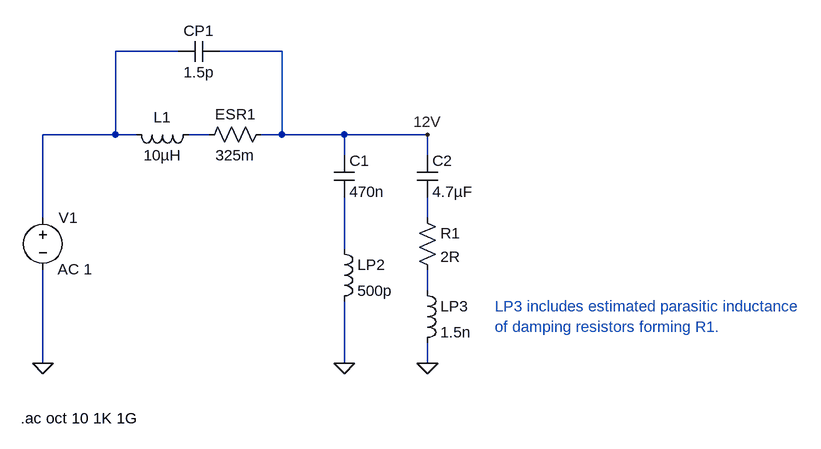
[diagram p0: schematic Boost Converter Output Filter.asc]
Boost Converter Output Filter.asc, the LTspice schematic file:
Version 4
SHEET 1 1708 680
WIRE 336 -80 240 -80
WIRE 496 -80 400 -80
WIRE 240 48 240 -80
WIRE 240 48 128 48
WIRE 272 48 240 48
WIRE 384 48 352 48
WIRE 496 48 496 -80
WIRE 496 48 464 48
WIRE 592 48 496 48
WIRE 720 48 592 48
WIRE 592 80 592 48
WIRE 720 80 720 48
WIRE 128 176 128 48
WIRE 720 176 720 144
WIRE 592 224 592 144
WIRE 720 288 720 256
WIRE 128 400 128 256
WIRE 592 400 592 304
WIRE 720 400 720 368
FLAG 128 400 0
FLAG 592 400 0
FLAG 720 400 0
FLAG 720 48 12V
SYMBOL voltage 128 160 R0
WINDOW 123 23 95 Left 2
WINDOW 39 0 0 Left 0
SYMATTR InstName V1
SYMATTR Value ""
SYMATTR Value2 AC 1
SYMBOL ind 368 32 R90
WINDOW 0 5 56 VBottom 2
WINDOW 3 32 56 VTop 2
SYMATTR InstName L1
SYMATTR Value 10µH
SYMBOL res 480 32 R90
WINDOW 0 0 56 VBottom 2
WINDOW 3 32 56 VTop 2
SYMATTR InstName ESR1
SYMATTR Value 325m
SYMBOL cap 400 -96 R90
WINDOW 0 0 32 VBottom 2
WINDOW 3 32 32 VTop 2
SYMATTR InstName CP1
SYMATTR Value 1.5p
SYMBOL cap 576 80 R0
SYMATTR InstName C1
SYMATTR Value 470n
SYMBOL cap 704 80 R0
SYMATTR InstName C2
SYMATTR Value 4.7µF
SYMBOL ind 576 208 R0
SYMATTR InstName LP2
SYMATTR Value 500p
SYMBOL res 704 160 R0
SYMATTR InstName R1
SYMATTR Value 2R
SYMBOL ind 704 272 R0
SYMATTR InstName LP3
SYMATTR Value 1.5n
TEXT 824 312 Left 2 ;LP3 includes estimated parasitic inductance\nof damping resistors forming R1.
TEXT 94 484 Left 2 !.ac oct 10 1K 1G

The netlist it stands for:
* Boost Converter Output Filter.asc
V1 N001 0 AC 1
L1 N002 N001 10µH
R§ESR1 12V N002 325m
CP1 12V N001 1.5p
C1 12V N004 470n
C2 12V N003 4.7µF
LP2 N004 0 500p
R1 N003 N005 2R
LP3 N005 0 1.5n
* LP3 includes estimated parasitic inductance
* of damping resistors forming R1.
.ac oct 10 1K 1G
.backanno
.end